# EAGLE design board2 (EAGLE 8.4.1)
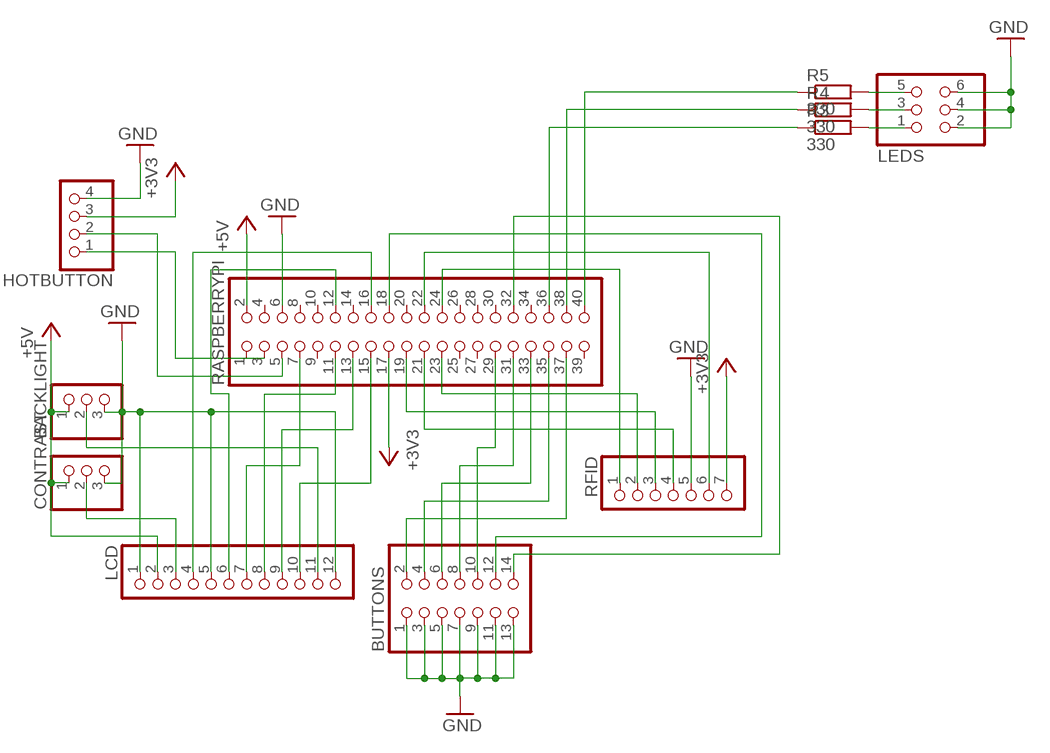
[diagram p0: schematic, sheet 1]

## Parts
BACKLIGHT  PINHD-1X3  [1X03]
BUTTONS  PINHD-2X7  [2X07]
CONTRAST  PINHD-1X3  [1X03]
HOTBUTTON  PINHD-1X4  [1X04]
LCD  PINHD-1X12  [1X12]
LEDS  PINHD-2X3  [2X03]
R3  330  R-EU_0207/10  [0207/10]
R4  330  R-EU_0207/10  [0207/10]
R5  330  R-EU_0207/10  [0207/10]
RASPBERRYPI  PINHD-2X20  [2X20]
RFID  PINHD-1X7  [1X07]

## Nets
+3V3: HOTBUTTON.3 RASPBERRYPI.17 RFID.7
+5V: BACKLIGHT.1 CONTRAST.1 LCD.2 RASPBERRYPI.2
GND: BACKLIGHT.3 BUTTONS.1 BUTTONS.3 BUTTONS.5 BUTTONS.7 BUTTONS.9 BUTTONS.11 BUTTONS.13 CONTRAST.3 HOTBUTTON.4 LCD.1 LCD.5 LCD.12 LEDS.2 LEDS.4 LEDS.6 RASPBERRYPI.6 RFID.5
N$1: RASPBERRYPI.22 RFID.6
N$2: RASPBERRYPI.24 RFID.1
N$3: RASPBERRYPI.23 RFID.2
N$4: RASPBERRYPI.19 RFID.3
N$5: RASPBERRYPI.21 RFID.4
N$6: CONTRAST.2 LCD.3
N$7: BACKLIGHT.2 LCD.11
N$8: BUTTONS.2 RASPBERRYPI.37
N$9: BUTTONS.4 RASPBERRYPI.35
N$11: LCD.4 RASPBERRYPI.16
N$12: LCD.6 RASPBERRYPI.12
N$13: LCD.7 RASPBERRYPI.7
N$14: LCD.8 RASPBERRYPI.11
N$15: LCD.9 RASPBERRYPI.13
N$16: LCD.10 RASPBERRYPI.15
N$17: BUTTONS.8 RASPBERRYPI.31
N$18: BUTTONS.10 RASPBERRYPI.29
N$19: BUTTONS.12 RASPBERRYPI.18
N$20: BUTTONS.14 RASPBERRYPI.32
N$21: LEDS.5 R5.2
N$22: LEDS.3 R4.2
N$23: LEDS.1 R3.2
N$24: R5.1 RASPBERRYPI.40
N$25: R4.1 RASPBERRYPI.38
N$26: R3.1 RASPBERRYPI.36
N$27: HOTBUTTON.1 RASPBERRYPI.3
N$28: HOTBUTTON.2 RASPBERRYPI.5
N$29: BUTTONS.6 RASPBERRYPI.33
Unconnected: RASPBERRYPI.1 RASPBERRYPI.4 RASPBERRYPI.8 RASPBERRYPI.9 RASPBERRYPI.10 RASPBERRYPI.14 RASPBERRYPI.20 RASPBERRYPI.25 RASPBERRYPI.26 RASPBERRYPI.27 RASPBERRYPI.28 RASPBERRYPI.30 RASPBERRYPI.34 RASPBERRYPI.39

## Library data of the parts
BACKLIGHT CONTRAST = pinhead:PINHD-1X3: PIN HEADER
BUTTONS = pinhead:PINHD-2X7: PIN HEADER
HOTBUTTON = pinhead:PINHD-1X4: PIN HEADER
LCD = pinhead:PINHD-1X12: PIN HEADER
LEDS = pinhead:PINHD-2X3: PIN HEADER
R3-R5 = rcl:R-EU_: RESISTOR, European symbol
RASPBERRYPI = pinhead:PINHD-2X20: PIN HEADER
RFID = pinhead:PINHD-1X7: PIN HEADER

## Board
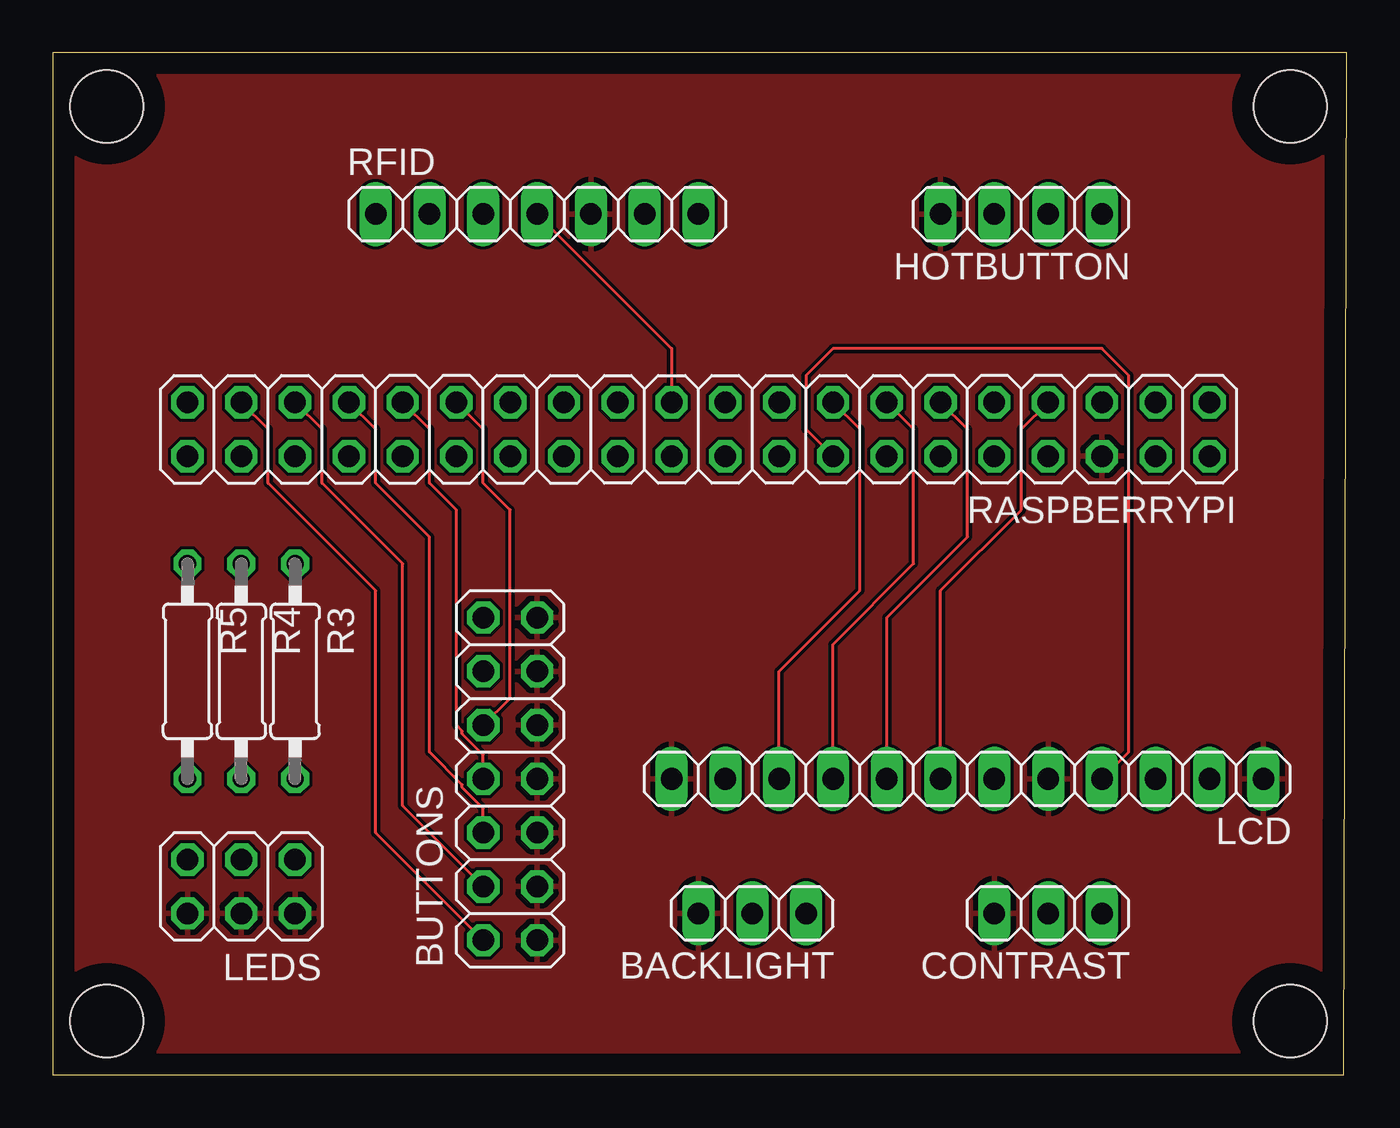
[diagram p1: board, top side]
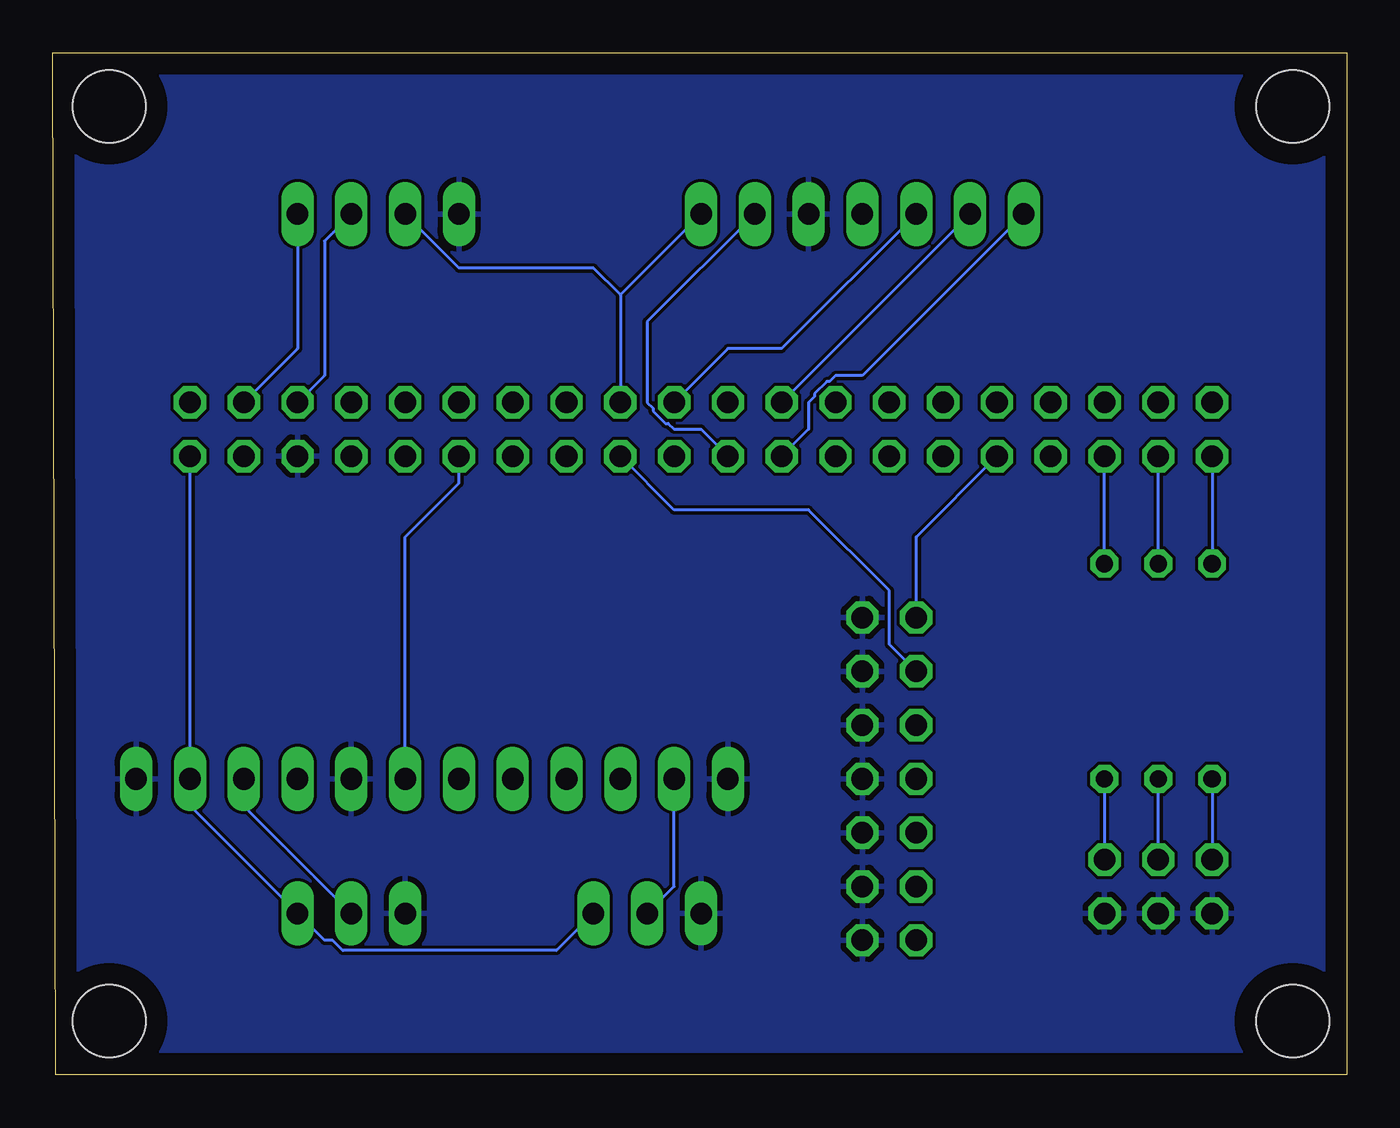
[diagram p2: board, bottom side, seen from below]

Size 61.08 x 48.25 mm. Coordinates in mm from the lower left corner, seen from the top.
Outline: 0,0 60.96,0 61.08,48.25 0,48.25 0,0
Copper layers (1*16): Top 0.035mm / dielectric 1.5mm / Bottom 0.035mm
Design rules "default": minimum track width 6mil, minimum drill 0.35mm, track to track 6mil, track to pad 6mil, pad to pad 6mil, via to via 6mil, smd to smd 6mil, copper to edge 40mil, drill to drill 6mil, minimum pad ring 10mil, minimum via ring 8mil, stop-mask expansion 4mil, vias tented up to drill 0mil, thermal gap 10mil
Holes 3.43 mm at 2.54,45.72 58.42,45.72 2.54,2.54 58.42,2.54

### Footprints (pad centres in the part's own frame; a part is rotated, then mirrored left to right if it is on the bottom)
1X03 = drill 1.016 long: 1 -2.54,0; 2 0,0; 3 2.54,0
2X07 = drill 1.016 octagon: 1 -7.62,-1.27; 2 -7.62,1.27; 3 -5.08,-1.27; 4 -5.08,1.27; 5 -2.54,-1.27; 6 -2.54,1.27; 7 0,-1.27; 8 0,1.27; 9 2.54,-1.27; 10 2.54,1.27; 11 5.08,-1.27; 12 5.08,1.27; 13 7.62,-1.27; 14 7.62,1.27
1X04 = drill 1.016 long: 1 -3.81,0; 2 -1.27,0; 3 1.27,0; 4 3.81,0
1X12 = drill 1.016 long: 1 -13.97,0; 2 -11.43,0; 3 -8.89,0; 4 -6.35,0; 5 -3.81,0; 6 -1.27,0; 7 1.27,0; 8 3.81,0; 9 6.35,0; 10 8.89,0; 11 11.43,0; 12 13.97,0
2X03 = drill 1.016 octagon: 1 -2.54,-1.27; 2 -2.54,1.27; 3 0,-1.27; 4 0,1.27; 5 2.54,-1.27; 6 2.54,1.27
0207/10 = drill 0.813 octagon: 1 -5.08,0; 2 5.08,0
2X20 = drill 1.016 octagon: 1 -24.13,-1.27; 2 -24.13,1.27; 3 -21.59,-1.27; 4 -21.59,1.27; 5 -19.05,-1.27; 6 -19.05,1.27; 7 -16.51,-1.27; 8 -16.51,1.27; 9 -13.97,-1.27; 10 -13.97,1.27; 11 -11.43,-1.27; 12 -11.43,1.27; 13 -8.89,-1.27; 14 -8.89,1.27; 15 -6.35,-1.27; 16 -6.35,1.27; 17 -3.81,-1.27; 18 -3.81,1.27; 19 -1.27,-1.27; 20 -1.27,1.27; 21 1.27,-1.27; 22 1.27,1.27; 23 3.81,-1.27; 24 3.81,1.27; 25 6.35,-1.27; 26 6.35,1.27; 27 8.89,-1.27; 28 8.89,1.27; 29 11.43,-1.27; 30 11.43,1.27; 31 13.97,-1.27; 32 13.97,1.27; 33 16.51,-1.27; 34 16.51,1.27; 35 19.05,-1.27; 36 19.05,1.27; 37 21.59,-1.27; 38 21.59,1.27; 39 24.13,-1.27; 40 24.13,1.27
1X07 = drill 1.016 long: 1 -7.62,0; 2 -5.08,0; 3 -2.54,0; 4 0,0; 5 2.54,0; 6 5.08,0; 7 7.62,0

### Placement (x,y rotation side)
BACKLIGHT  33.02,7.62 180 top
BUTTONS  21.59,13.97 90 top
CONTRAST  46.99,7.62 180 top
HOTBUTTON  45.72,40.64 180 top
LCD  43.18,13.97 180 top
LEDS  8.89,8.89 180 top
R3  11.43,19.05 270 top
R4  8.89,19.05 270 top
R5  6.35,19.05 270 top
RASPBERRYPI  30.48,30.48 180 top
RFID  22.86,40.64 0 top

### Tracks (layer width: path | path; a pad name or v marks a point on that pad's centre or on a via)
+3V3
  Bottom 0.152: RFID.7 34.29,36.83 | 34.29,36.83 RASPBERRYPI.17 | 34.29,36.83 35.56,38.1 41.91,38.1 HOTBUTTON.3
+5V
  Bottom 0.152: RASPBERRYPI.2 LCD.2 54.61,12.7 CONTRAST.1 48.26,6.35 47.88,6.35 47.4,5.87 37.31,5.87 BACKLIGHT.1
GND
  pour Bottom: 0,48.26 60.96,48.26 60.96,0 0,0
  pour Top: 0,48.26 60.96,48.26 60.96,0 0,0
N$1
  Bottom 0.152: RFID.6 33.02,35.56 33.02,31.75 32.74,31.47 32.74,31.34 32.16,30.76 32.03,30.76 31.75,30.48 30.48,30.48 RASPBERRYPI.22
N$2
  Bottom 0.152: RFID.1 22.86,33.02 24.13,33.02 24.41,32.74 24.54,32.74 25.12,32.16 25.12,32.03 25.4,31.75 25.4,30.48 RASPBERRYPI.24
N$3
  Bottom 0.152: RFID.2 RASPBERRYPI.23
N$4
  Bottom 0.152: RFID.3 26.67,34.29 29.21,34.29 RASPBERRYPI.19
N$5
  Top 0.152: RFID.4 29.21,34.29 RASPBERRYPI.21
N$6
  Bottom 0.152: CONTRAST.2 52.07,12.7 LCD.3
N$7
  Bottom 0.152: BACKLIGHT.2 31.75,8.89 LCD.11
N$8
  Top 0.152: BUTTONS.2 15.24,11.43 15.24,22.86 10.16,27.94 10.16,30.48 RASPBERRYPI.37
N$9
  Top 0.152: BUTTONS.4 16.51,12.7 16.51,24.13 12.7,27.94 12.7,30.48 RASPBERRYPI.35
N$11
  Top 0.152: LCD.4 50.8,15.24 50.8,33.02 49.53,34.29 36.83,34.29 35.56,33.02 35.56,30.48 RASPBERRYPI.16
N$12
  Bottom 0.152: RASPBERRYPI.12 41.91,27.94 44.45,25.4 LCD.6
N$13
  Top 0.152: LCD.7 41.91,22.86 45.72,26.67 45.72,30.48 RASPBERRYPI.7
N$14
  Top 0.152: LCD.8 39.37,21.59 43.18,25.4 43.18,30.48 RASPBERRYPI.11
N$15
  Top 0.152: LCD.9 36.83,20.32 40.64,24.13 40.64,30.48 RASPBERRYPI.13
N$16
  Top 0.152: LCD.10 34.29,19.05 38.1,22.86 38.1,30.48 RASPBERRYPI.15
N$17
  Top 0.152: BUTTONS.8 20.32,15.11 19.33,16.1 19.33,16.23 19.05,16.51 19.05,26.67 17.78,27.94 17.78,30.48 RASPBERRYPI.31
N$18
  Top 0.152: BUTTONS.10 21.59,17.78 21.59,26.67 20.32,27.94 20.32,30.48 RASPBERRYPI.29
N$19
  Bottom 0.152: BUTTONS.12 21.59,20.32 21.59,22.86 25.4,26.67 31.75,26.67 RASPBERRYPI.18
N$20
  Bottom 0.152: BUTTONS.14 20.32,25.4 RASPBERRYPI.32
N$21
  Bottom 0.152: R5.2 LEDS.5
N$22
  Bottom 0.152: LEDS.3 R4.2
N$23
  Bottom 0.152: R3.2 LEDS.1
N$24
  Bottom 0.152: RASPBERRYPI.40 R5.1
N$25
  Bottom 0.152: R4.1 RASPBERRYPI.38
N$26
  Bottom 0.152: R3.1 RASPBERRYPI.36
N$27
  Bottom 0.152: HOTBUTTON.1 49.53,34.29 RASPBERRYPI.3
N$28
  Bottom 0.152: HOTBUTTON.2 48.26,39.37 48.26,33.02 RASPBERRYPI.5
N$29
  Top 0.152: BUTTONS.6 20.32,12.57 19.33,13.56 19.33,13.69 17.78,15.24 17.78,25.4 15.24,27.94 15.24,30.48 RASPBERRYPI.33